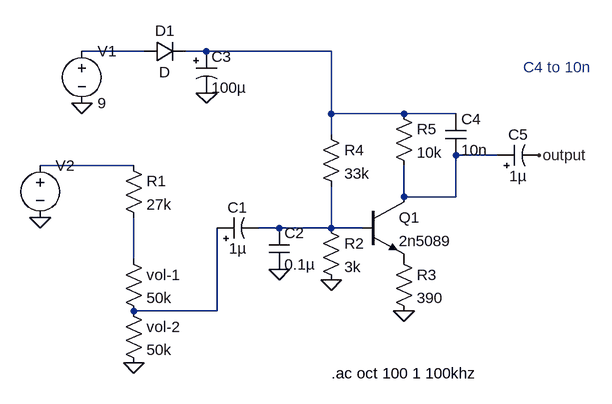
[diagram p0: schematic ehx - hogs foot.asc]
ehx - hogs foot.asc, the LTspice schematic file:
Version 4
SHEET 1 880 680
WIRE 32 112 -64 112
WIRE 128 112 96 112
WIRE 320 112 128 112
WIRE 320 208 320 112
WIRE 432 208 320 208
WIRE 512 208 432 208
WIRE 320 240 320 208
WIRE 576 272 512 272
WIRE 16 288 -128 288
WIRE 432 336 432 288
WIRE 512 336 512 272
WIRE 512 336 432 336
WIRE 240 384 208 384
WIRE 320 384 320 320
WIRE 320 384 240 384
WIRE 368 384 320 384
WIRE 16 432 16 368
WIRE 144 512 144 384
WIRE 144 512 16 512
FLAG -64 192 0
FLAG -128 368 0
FLAG 240 448 0
FLAG 320 464 0
FLAG 16 592 0
FLAG 128 176 0
FLAG 432 512 0
FLAG 640 272 output
SYMBOL voltage -64 96 R0
SYMATTR InstName V1
SYMATTR Value 9
SYMBOL voltage -128 272 R0
SYMATTR InstName V2
SYMATTR Value ""
SYMATTR Value2 AC 1
SYMBOL res 0 272 R0
SYMATTR InstName R1
SYMATTR Value 27k
SYMBOL res 0 416 R0
SYMATTR InstName vol-1
SYMATTR Value 50k
SYMBOL res 0 496 R0
SYMATTR InstName vol-2
SYMATTR Value 50k
SYMBOL polcap 144 400 R270
WINDOW 0 32 32 VTop 2
WINDOW 3 0 32 VBottom 2
SYMATTR InstName C1
SYMATTR Value 1µ
SYMBOL cap 224 384 R0
SYMATTR InstName C2
SYMATTR Value 0.1µ
SYMBOL res 304 368 R0
SYMATTR InstName R2
SYMATTR Value 3k
SYMBOL res 304 224 R0
SYMATTR InstName R4
SYMATTR Value 33k
SYMBOL diode 32 128 R270
WINDOW 0 32 32 VTop 2
WINDOW 3 0 32 VBottom 2
SYMATTR InstName D1
SYMBOL polcap 112 112 R0
SYMATTR InstName C3
SYMATTR Value 100µ
SYMBOL res 416 192 R0
SYMATTR InstName R5
SYMATTR Value 10k
SYMBOL npn 368 336 R0
SYMATTR InstName Q1
SYMATTR Value 2n5089
SYMBOL res 416 416 R0
SYMATTR InstName R3
SYMATTR Value 390
SYMBOL cap 496 208 R0
SYMATTR InstName C4
SYMATTR Value 10n
SYMBOL polcap 576 288 R270
WINDOW 0 32 32 VTop 2
WINDOW 3 0 32 VBottom 2
SYMATTR InstName C5
SYMATTR Value 1µ
TEXT 320 608 Left 2 !.ac oct 100 1 100khz
TEXT 616 136 Left 2 ;C4 to 10n

The netlist it stands for:
* ehx - hogs foot.asc
V1 N001 0 9
V2 N004 0 AC 1
R1 N004 N006 27k
R§vol-1 N006 N007 50k
R§vol-2 N007 0 50k
C1 N007 N005 1µ
C2 N005 0 0.1µ
R2 N005 0 3k
R4 N002 N005 33k
D1 N001 N002 D
C3 N002 0 100µ
R5 N002 N003 10k
Q1 N003 N005 P001 0 2n5089
R3 P001 0 390
C4 N002 N003 10n
C5 N003 output 1µ
.model D D
.lib standard.dio
.model NPN NPN
.model PNP PNP
.lib standard.bjt
.ac oct 100 1 100khz
* C4 to 10n
.backanno
.end